# Altium schematic sheet hbridgeB.SchDoc
size A4; SheetNumber: 6; SheetTotal: 11
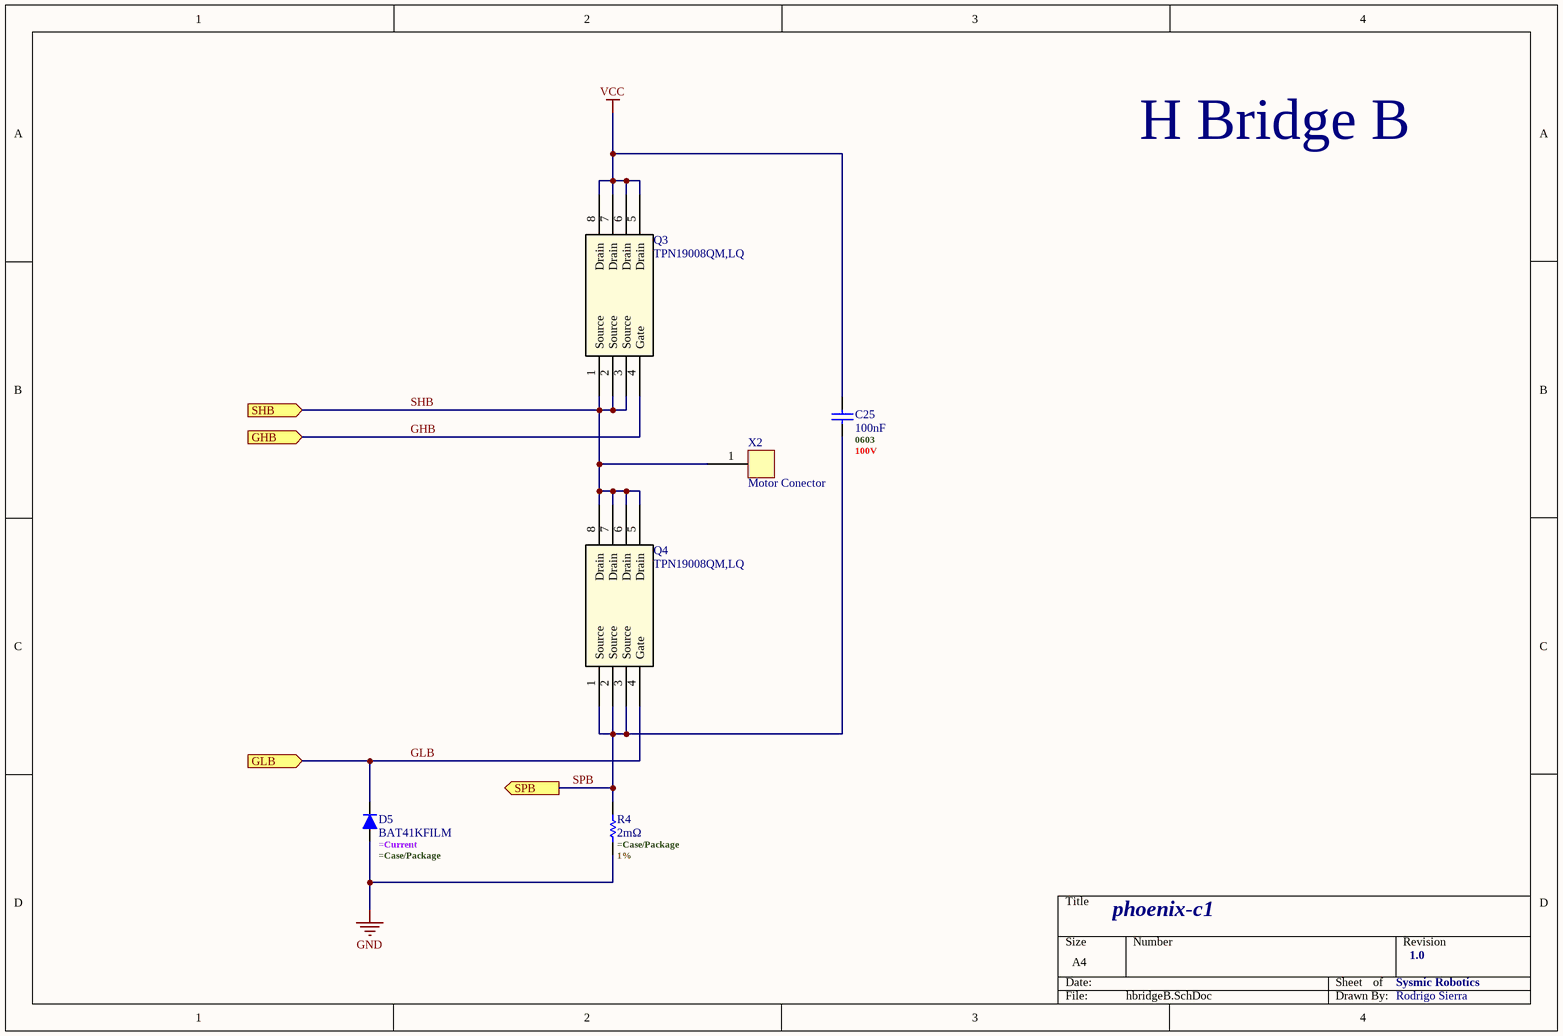
[diagram p0: hbridgeB.SchDoc]

## Parts
C25  100nF  .Case/Package: 0603  .Voltage Rating (DC): 100V  [C0603 - MURATA]
D5  BAT41KFILM  [DSOD-523 - STMicroelectronics]
Q3  TPN19008QM,LQ  [8-TSON - TOSHIBA]
Q4  TPN19008QM,LQ  [8-TSON - TOSHIBA]
R4  2mΩ  .Tolerance: 1%  [R0805 - SEI]
X2  Motor Conector  [CONN_PHASE01x01]

## Ports
GHB (in, see phoenix-c1-sch[4C], gate_driver[3B]), GLB (in, see phoenix-c1-sch[4C], gate_driver[3B]), SHB (in, see phoenix-c1-sch[4C], gate_driver[3B]), SPB (out, see phoenix-c1-sch[4C], gate_driver[3B])

## Nets
GND: D5.2 R4.1
VCC: C25.2 Q3.5(Drain) Q3.6(Drain) Q3.7(Drain) Q3.8(Drain)
GHB: Q3.4(Gate) ; port GHB
GLB: D5.1 Q4.4(Gate) ; port GLB
SHB: Q3.1(Source) Q3.2(Source) Q3.3(Source) Q4.5(Drain) Q4.6(Drain) Q4.7(Drain) Q4.8(Drain) X2.1(Conn) ; port SHB
SPB: C25.1 Q4.1(Source) Q4.2(Source) Q4.3(Source) R4.2 ; port SPB

## Notes on the sheet
- H Bridge B
- phoenix-c1
- Sysmic Robotics
- 1.0
- Rodrigo Sierra

## Library data of the parts
C25 = GCJ188R72A104KA01D: Cap Ceramic 0.1uF 100V X7R 10% Pad SMD 0603 Soft Termination 125C Automotive T/R; Manufacturer: Murata; Manufacturer Lifecycle Status: IN PRODUCTION; Supplier: Avnet; Supplier Part Number: GCJ188R72A104KA01D; Manufacturer Part Number: GCJ188R72A104KA01D; RoHS: Compliant; Category: Ceramic Capacitors; Stock: 848000; Pricing: 4000=0,02065 (USD); Value: 100nF; Case/Package: 0603; Case Code (Imperial): 0603; Case Code (Metric): 1608; Dielectric Material: Ceramic; Features: Soft Termination; Height: 800µm; Lead Free: Lead Free; Length: 1.6mm; Lifecycle Status: Production; Material: Ceramic; Max Operating Temperature: 125°C; Min Operating Temperature: -55°C; Mounting Technology: Surface Mount; Number of Terminals: 2; Ratings: AEC-Q200; REACH SVHC: Yes; Schedule B: 8532240020, 8532240020|8532240020, 8532240020|8532240020|8532240020, 8532240020|8532240020|8532240020|8532240020; Tolerance: 10%; Voltage Rating: 100V; Voltage Rating (DC): 100V; Width: 800µm; ComponentLink1URL: https://datasheet.octopart.com:443/GCJ188R72A104KA01D-Murata-datasheet-141264712.pdf?src-supplier=Geoflip; ComponentLink1Description: https://datasheet.octopart.com:443/GCJ188R72A104KA01D-Murata-datasheet-141264712.pdf?src-supplier=Geoflip; ComponentLink2URL: https://datasheet.octopart.com:443/GCJ188R72A104KA01D-Murata-datasheet-140654819.pdf?src-supplier=Ciiva; ComponentLink2Description: https://datasheet.octopart.com:443/GCJ188R72A104KA01D-Murata-datasheet-140654819.pdf?src-supplier=Ciiva; ComponentLink3URL: https://datasheet.octopart.com:443/GCJ188R72A104KA01D-Murata-datasheet-138714490.pdf?src-supplier=Ciiva; ComponentLink3Description: https://datasheet.octopart.com:443/GCJ188R72A104KA01D-Murata-datasheet-138714490.pdf?src-supplier=Ciiva; ComponentLink4URL: https://datasheet.octopart.com:443/GCJ188R72A104KA01D-Murata-datasheet-165611796.pdf?src-supplier=TME; ComponentLink4Description: https://datasheet.octopart.com:443/GCJ188R72A104KA01D-Murata-datasheet-165611796.pdf?src-supplier=TME; ComponentLink5URL: https://datasheet.octopart.com:443/GCJ188R72A104KA01D-Murata-datasheet-128592638.pdf?src-supplier=X-ON; ComponentLink5Description: https://datasheet.octopart.com:443/GCJ188R72A104KA01D-Murata-datasheet-128592638.pdf?src-supplier=X-ON; ComponentLink6URL: https://datasheet.octopart.com:443/GCJ188R72A104KA01D-Murata-datasheet-78375067.pdf?src-supplier=Future+Electronics; ComponentLink6Description: https://datasheet.octopart.com:443/GCJ188R72A104KA01D-Murata-datasheet-78375067.pdf?src-supplier=Future+Electronics; ComponentLink7URL: https://datasheet.octopart.com:443/GCJ188R72A104KA01D-Murata-datasheet-12532847.pdf?src-supplier=Future+Electronics; ComponentLink7Description: https://datasheet.octopart.com:443/GCJ188R72A104KA01D-Murata-datasheet-12532847.pdf?src-supplier=Future+Electronics; ComponentLink8URL: http://sigma.octopart.com:80/reach_statement/Murata-company-16.pdf?src-supplier=Compliance+Statements; ComponentLink8Description: http://sigma.octopart.com:80/reach_statement/Murata-company-16.pdf?src-supplier=Compliance+Statements; Supplier 1: Mouser; Supplier Part Number 1: 81-GCJ188R72A104KA1D
D5 = BAT41KFILM: Low Capacitance Small Signal 200 mA 1 V Schottky Diode Surface Mount - SOD-523; Manufacturer: STMicroelectronics; Average Rectified Current: 200mA; Value: 3pF; Element Configuration: Single; Forward Voltage: 450mV; Max Forward Surge Current (Ifsm): 1A; Max Junction Temperature (Tj): 150°C; Max Repetitive Reverse Voltage (Vrrm): 100V; Max Reverse Leakage Current: 100nA; Number of Elements: 1; Polarity: Standard; Supplier: Mouser; Supplier Part Number: 511-BAT41KFILM; Manufacturer Part Number: BAT41KFILM; RoHS: Compliant; Category: Schottky Diodes; Stock: 54328; Pricing: 1=0,34, 10=0,206, 50=0,206, 100=0,129, 1000=0,085, 10000=0,054 (USD); China RoHS: Compliant; Contact Plating: Tin; Current Rating: 200mA; Forward Current: 200mA; Height: 700µm; Lead Free: Lead Free; Length: 1.3mm; Lifecycle Status: Production; Max Operating Temperature: 150°C; Max Output current: 200mA; Max Reverse Voltage (DC): 100V; Max Surge Current: 1A; Min Operating Temperature: -65°C; Mounting Technology: Surface Mount; Pins: 2; Number of Terminals: 2; Output Current: 200mA; Packaging: Tape and Reel; Peak Non-Repetitive Surge Current: 1A; Peak Reverse Current: 100nA; Radiation Hardening: No; REACH SVHC: Yes; Reverse Standoff Voltage: 100V; Schedule B: 8541100070, 8541100070|8541100070|8541100070|8541100070|8541100070; Voltage Rating (DC): 100V; Width: 900µm; ComponentLink1URL: https://datasheet.octopart.com:443/BAT41KFILM-STMicroelectronics-datasheet-12514395.pdf?src-supplier=Upverter; ComponentLink1Description: https://datasheet.octopart.com:443/BAT41KFILM-STMicroelectronics-datasheet-12514395.pdf?src-supplier=Upverter; ComponentLink2URL: https://datasheet.octopart.com:443/BAT41KFILM-STMicroelectronics-datasheet-8379388.pdf?src-supplier=element14+APAC; ComponentLink2Description: https://datasheet.octopart.com:443/BAT41KFILM-STMicroelectronics-datasheet-8379388.pdf?src-supplier=element14+APAC; ComponentLink3URL: https://datasheet.octopart.com:443/BAT41KFILM-STMicroelectronics-datasheet-165583346.pdf?src-supplier=Newark; ComponentLink3Description: https://datasheet.octopart.com:443/BAT41KFILM-STMicroelectronics-datasheet-165583346.pdf?src-supplier=Newark; ComponentLink4URL: https://datasheet.octopart.com:443/BAT41KFILM-STMicroelectronics-datasheet-109502.pdf?src-supplier=Nu+Horizons; ComponentLink4Description: https://datasheet.octopart.com:443/BAT41KFILM-STMicroelectronics-datasheet-109502.pdf?src-supplier=Nu+Horizons; Supplier 1: Mouser; Supplier Part Number 1: 511-BAT41KFILM; .Current: =Current; .Case/Package: =Case/Package
Q3 Q4 = TPN19008QM,LQ: Power MOSFET, N Channel, 80 V, 38 A, 0.0147 ohm, TSON, Surface Mount; Manufacturer_Name: Toshiba Electronic Devices & Storage Corp.; Copyright: Copyright (C) 2025 Ultra Librarian. All rights reserved.; Manufacturer_Part_Number: TPN19008QM,LQ; RefDes: RefDes; Type: Type; Supplier 1: Mouser; Supplier Part Number 1: 757-TPN19008QM,LQ
R4 = CSSH0805FT2L00: Res Metal Alloy 0805 0.002 Ohm 1% 1W ±75ppm/C Pad SMD T/R Automotive AEC-Q200; Manufacturer: Stackpole Electronics; Temperature Coefficient: 75ppm/°C; Working Voltage: 44.7mV; Supplier: Mouser; Supplier Part Number: 708-CSSH0805FT2L00; Manufacturer Part Number: CSSH0805FT2L00; RoHS: Compliant; Category: Chip SMD Resistors; Stock: 6684; Pricing: 1=0,6, 10=0,385, 50=0,29, 100=0,261, 1000=0,188, 10000=0,144 (USD); Height: 350µm; Lifecycle Status: Production; Max Operating Temperature: 170°C; Min Operating Temperature: -55°C; Mounting Technology: Surface Mount; Number of Terminals: 2; Power Dissipation: 1W; REACH SVHC: Yes; Value: 2mΩ; Schedule B: 8533210045, 8533210045|8533210045|8533210045|8533210045|8533210045; Tolerance: 1%; Width: 1.3mm; ComponentLink1URL: https://datasheet.octopart.com:443/CSSH0805FT2L00-Stackpole-Electronics-datasheet-182147922.pdf?src-supplier=IHS; ComponentLink1Description: https://datasheet.octopart.com:443/CSSH0805FT2L00-Stackpole-Electronics-datasheet-182147922.pdf?src-supplier=IHS; ComponentLink2URL: https://datasheet.octopart.com:443/CSSH0805FT2L00-Stackpole-Electronics-datasheet-141193806.pdf?src-supplier=Stackpole+Electronics; ComponentLink2Description: https://datasheet.octopart.com:443/CSSH0805FT2L00-Stackpole-Electronics-datasheet-141193806.pdf?src-supplier=Stackpole+Electronics; ComponentLink3URL: https://datasheet.octopart.com:443/CSSH0805FT2L00-Stackpole-Electronics-datasheet-141158304.pdf?src-supplier=Stackpole+Electronics; ComponentLink3Description: https://datasheet.octopart.com:443/CSSH0805FT2L00-Stackpole-Electronics-datasheet-141158304.pdf?src-supplier=Stackpole+Electronics; ComponentLink4URL: https://datasheet.octopart.com:443/CSSH0805FT2L00-Stackpole-Electronics-datasheet-101746695.pdf?src-supplier=Future+Electronics; ComponentLink4Description: https://datasheet.octopart.com:443/CSSH0805FT2L00-Stackpole-Electronics-datasheet-101746695.pdf?src-supplier=Future+Electronics; ComponentLink5URL: http://sigma.octopart.com:80/141158211/reach_statement/Stackpole-Electronics-CSSH0805FT2L00.pdf?src-supplier=Compliance+Statements; ComponentLink5Description: http://sigma.octopart.com:80/141158211/reach_statement/Stackpole-Electronics-CSSH0805FT2L00.pdf?src-supplier=Compliance+Statements; ComponentLink6URL: http://sigma.octopart.com:80/141158212/rohs_statement/Stackpole-Electronics-CSSH0805FT2L00.pdf?src-supplier=Compliance+Statements; ComponentLink6Description: http://sigma.octopart.com:80/141158212/rohs_statement/Stackpole-Electronics-CSSH0805FT2L00.pdf?src-supplier=Compliance+Statements; Supplier 1: Mouser; Supplier Part Number 1: 708-CSSH0805FT2L00; .Case/Package: =Case/Package
X2 = Conn_01x01: Generic connector, single row